# EAGLE design 音声ガイド (EAGLE 9.7.0)
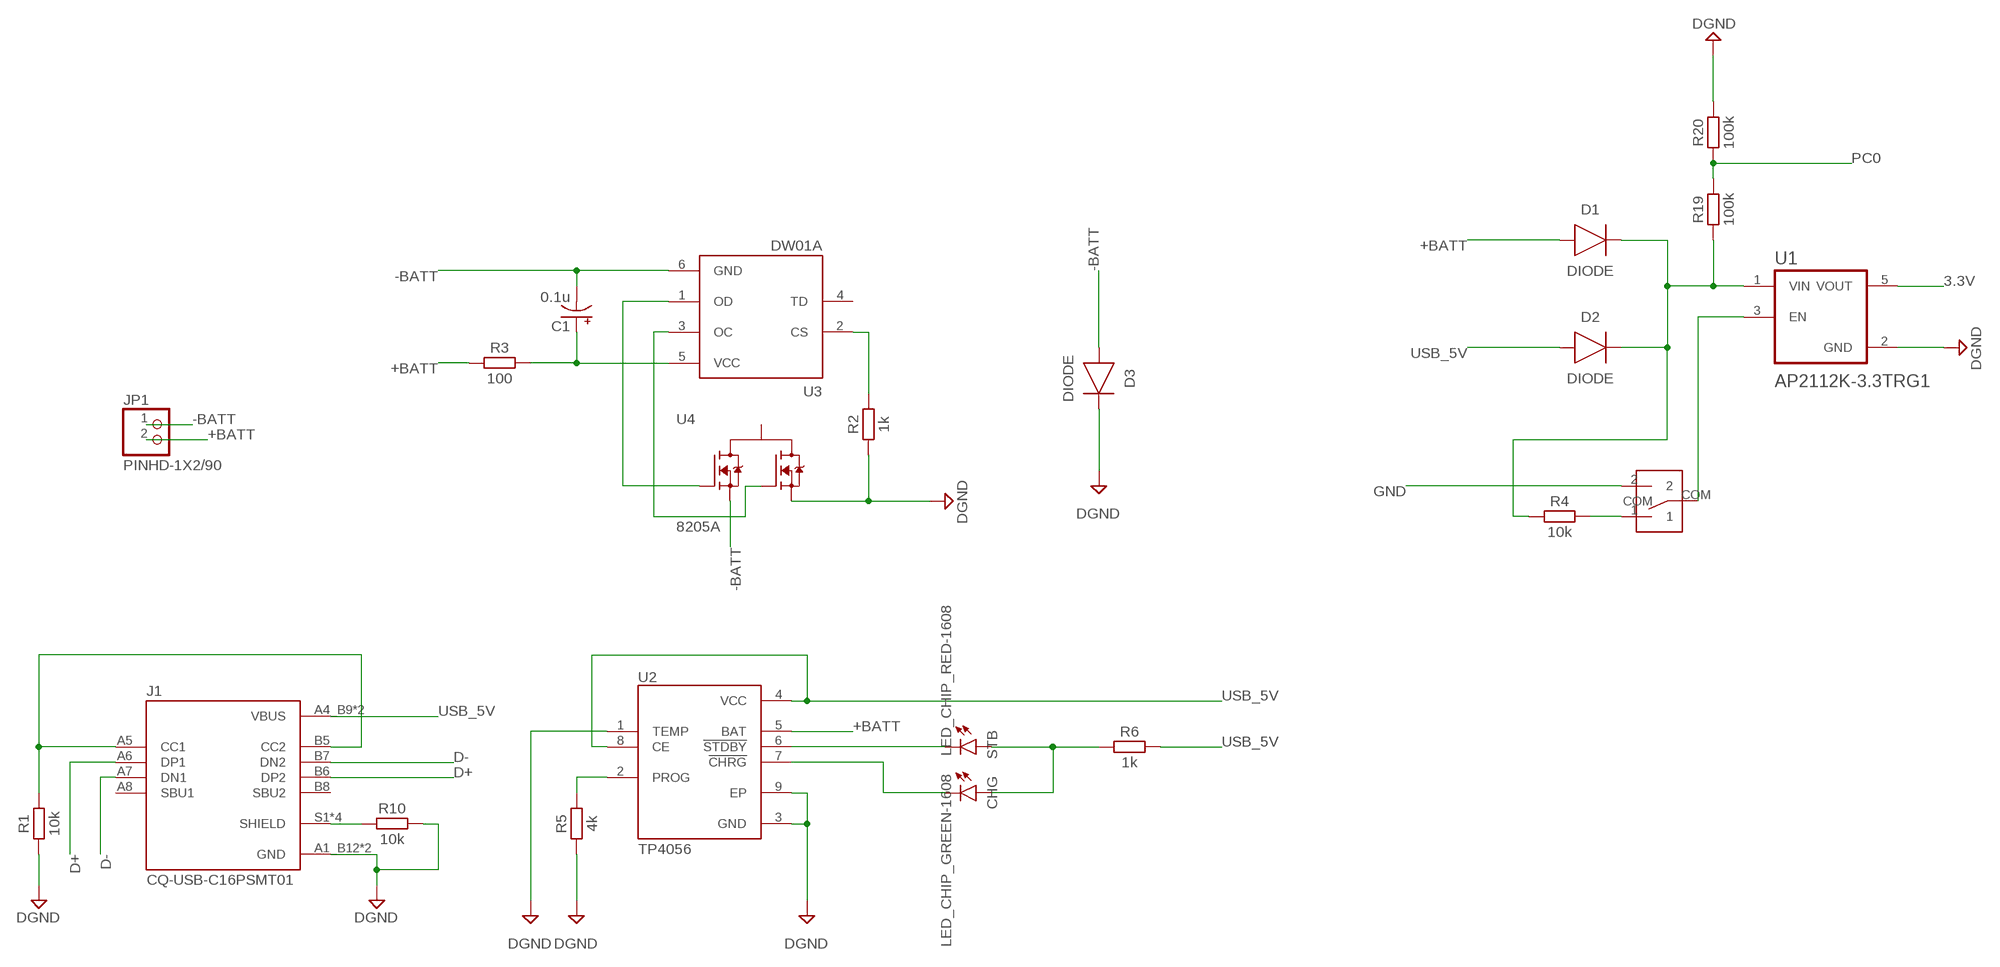
[diagram p0: schematic, sheet 1, part 1 of 2]
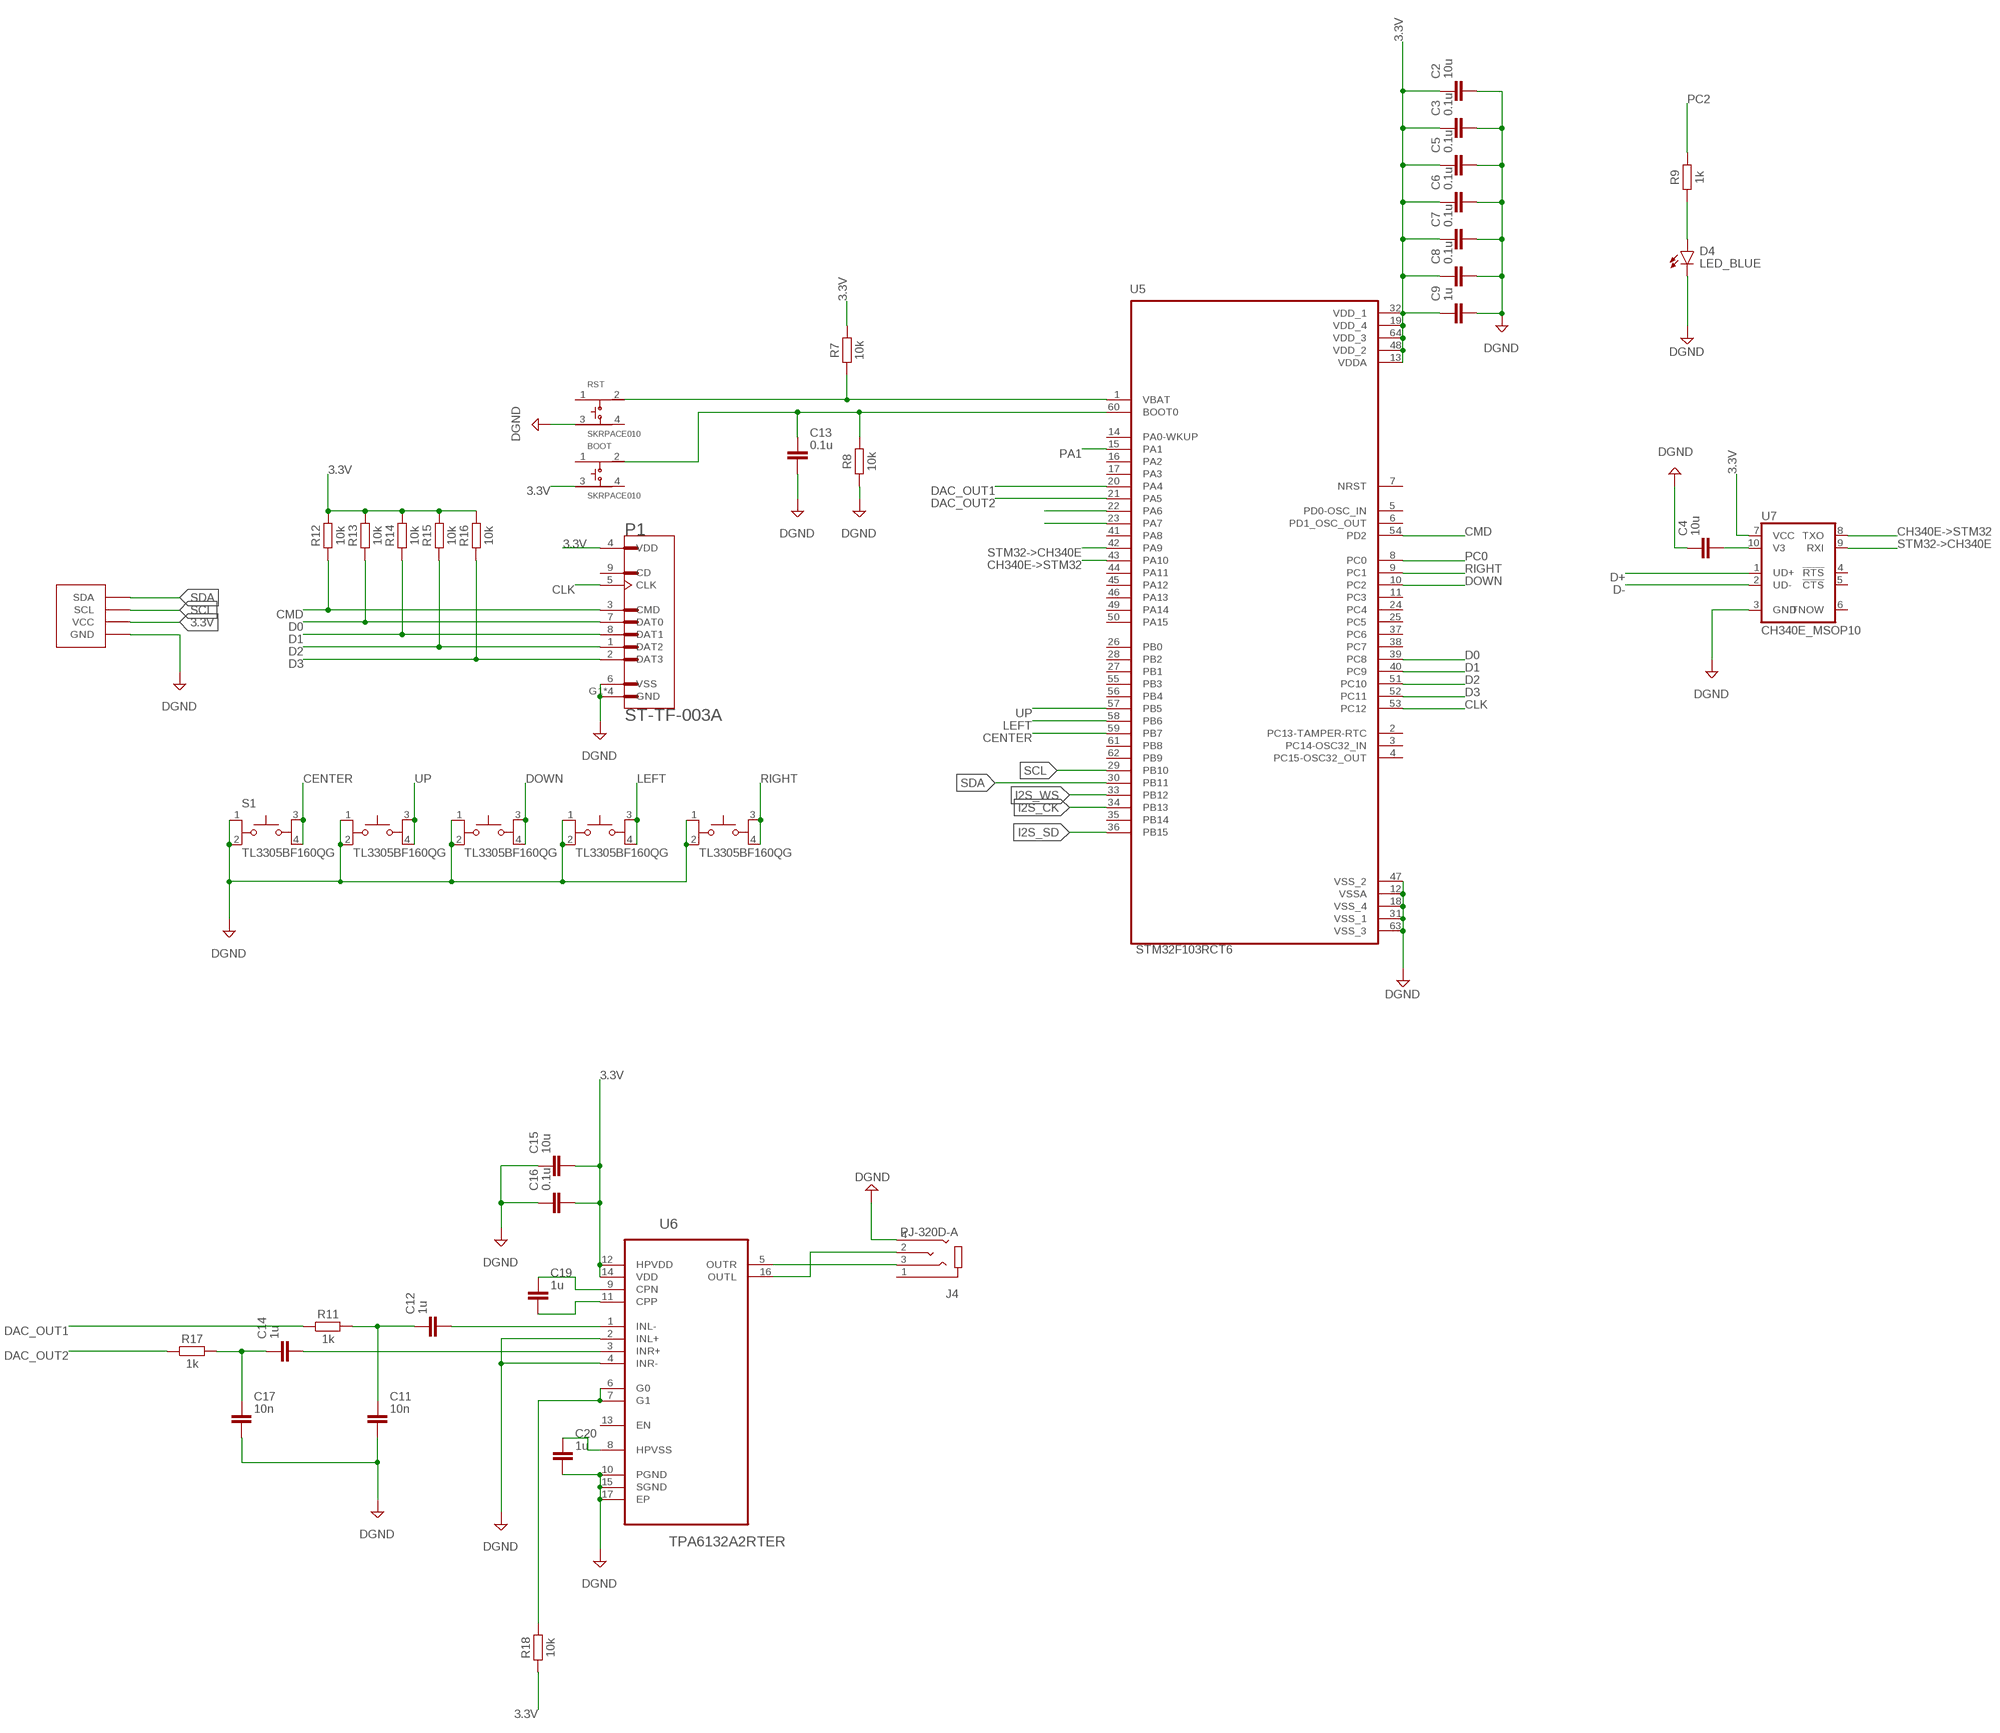
[diagram p1: schematic, sheet 1, part 2 of 2]

## Parts
BOOT  SKRPACE010  [SW_SKRPACE010]
C1  0.1u  C-POL-US_TANTALUM-1206(3216-METRIC)  [CAPMP3216X180N]
C2  10u  C_CHIP-0402(1005-METRIC)  [CAPC1005X60]
C3  0.1u  C_CHIP-0402(1005-METRIC)  [CAPC1005X60]
C4  10u  C_CHIP-0402(1005-METRIC)  [CAPC1005X60]
C5  0.1u  C_CHIP-0402(1005-METRIC)  [CAPC1005X60]
C6  0.1u  C_CHIP-0402(1005-METRIC)  [CAPC1005X60]
C7  0.1u  C_CHIP-0402(1005-METRIC)  [CAPC1005X60]
C8  0.1u  C_CHIP-0402(1005-METRIC)  [CAPC1005X60]
C9  1u  C_CHIP-0402(1005-METRIC)  [CAPC1005X60]
C11  10n  C_CHIP-0402(1005-METRIC)  [CAPC1005X60]
C12  1u  C_CHIP-0402(1005-METRIC)  [CAPC1005X60]
C13  0.1u  C_CHIP-0402(1005-METRIC)  [CAPC1005X60]
C14  1u  C_CHIP-0402(1005-METRIC)  [CAPC1005X60]
C15  10u  C_CHIP-0402(1005-METRIC)  [CAPC1005X60]
C16  0.1u  C_CHIP-0402(1005-METRIC)  [CAPC1005X60]
C17  10n  C_CHIP-0402(1005-METRIC)  [CAPC1005X60]
C19  1u  C_CHIP-0402(1005-METRIC)  [CAPC1005X60]
C20  1u  C_CHIP-0402(1005-METRIC)  [CAPC1005X60]
CHG  LED_CHIP_GREEN-1608  [LEDC1608X39N_G]
D1  DIODE  DIODEDO-214AC(SMA)  [DIOM5226X290N]
D2  DIODE  DIODEDO-214AC(SMA)  [DIOM5226X290N]
D3  DIODE  DIODEDO-214AC(SMA)  [DIOM5226X290N]
D4  LED_BLUE  CHIP-FLAT-B_0603-0.35MM  [LEDC1608X35N_FLAT-B]
J1  CQ-USB-C16PSMT01  [SHENZHEN-CHUANGQIN-TECHNOLOGY_CQ-USB-C16PSMT01]
J4  PJ-320D-A  [HRO_PJ-320D-A]
JP1  PINHD-1X2/90  [1X02/90]
P1  ST-TF-003A  [SUNTECH_ST-TF-003A]
R1  10k  R_CHIP-0603(1608-METRIC)  [RESC1608X60]
R2  1k  R_CHIP-0603(1608-METRIC)  [RESC1608X60]
R3  100  R_CHIP-0603(1608-METRIC)  [RESC1608X60]
R4  10k  R_CHIP-0603(1608-METRIC)  [RESC1608X60]
R5  4k  R_CHIP-0603(1608-METRIC)  [RESC1608X60]
R6  1k  R_CHIP-0603(1608-METRIC)  [RESC1608X60]
R7  10k  R_CHIP-0603(1608-METRIC)  [RESC1608X60]
R8  10k  R_CHIP-0603(1608-METRIC)  [RESC1608X60]
R9  1k  R_CHIP-0603(1608-METRIC)  [RESC1608X60]
R10  10k  R_CHIP-0603(1608-METRIC)  [RESC1608X60]
R11  1k  R_CHIP-0603(1608-METRIC)  [RESC1608X60]
R12  10k  R_CHIP-0603(1608-METRIC)  [RESC1608X60]
R13  10k  R_CHIP-0603(1608-METRIC)  [RESC1608X60]
R14  10k  R_CHIP-0603(1608-METRIC)  [RESC1608X60]
R15  10k  R_CHIP-0603(1608-METRIC)  [RESC1608X60]
R16  10k  R_CHIP-0603(1608-METRIC)  [RESC1608X60]
R17  1k  R_CHIP-0603(1608-METRIC)  [RESC1608X60]
R18  10k  R_CHIP-0603(1608-METRIC)  [RESC1608X60]
R19  100k  R_CHIP-0603(1608-METRIC)  [RESC1608X60]
R20  100k  R_CHIP-0603(1608-METRIC)  [RESC1608X60]
RST  SKRPACE010  [SW_SKRPACE010]
S1  TL3305BF160QG  [SW_TL3305BF160QG]
S2  TL3305BF160QG  [SW_TL3305BF160QG]
S3  TL3305BF160QG  [SW_TL3305BF160QG]
S4  TL3305BF160QG  [SW_TL3305BF160QG]
S5  TL3305BF160QG  [SW_TL3305BF160QG]
STB  LED_CHIP_RED-1608  [LEDC1608X39N_R]
SW1  SK12D07VG4  [SK12D07VG4]
U1  AP2112K-3.3TRG1  [SOT95P285X140-5N]
U2  TP4056  [SOP127P600X175-9N]
U3  DW01A  [SOT95P280X145-6N]
U4  8205A  [SOT95P285X140-6N]
U5  STM32F103RCT6  [QFP50P1200X1200X160-64N]
U6  TPA6132A2RTER  [QFN50P300X300X80-16N]
U7  CH340E_MSOP10  [MSOP10]
U$1  HS96L03W2C03  [HS96L03W2C03]

## Nets
3.3V: BOOT.3 C2.1 C3.1 C5.1 C6.1 C7.1 C8.1 C9.1 C15.2 C16.2 P1.4(VDD) R7.2 R12.2 R13.2 R14.2 R15.2 R16.2 R18.1 U1.5(VOUT) U5.13(VDDA) U5.19(VDD_4) U5.32(VDD_1) U5.48(VDD_2) U5.64(VDD_3) U6.12(HPVDD) U6.14(VDD) U7.7(VCC) U$1.P$2(VCC)
+BATT: D1.2(A) JP1.2 R3.1 U2.5(BAT)
-BATT: C1.2(-) D3.2(A) JP1.1 U3.6(GND) U4.1(S1)
CENTER: S1.3 S1.4 U5.59(PB7)
CH340E->STM32: U5.43(PA10) U7.8(TXO)
CLK: P1.5(CLK) U5.53(PC12)
CMD: P1.3(CMD) R12.1 U5.54(PD2)
D0: P1.7(DAT0) R13.1 U5.39(PC8)
D1: P1.8(DAT1) R14.1 U5.40(PC9)
D2: P1.1(DAT2) R15.1 U5.51(PC10)
D3: P1.2(DAT3) R16.1 U5.52(PC11)
D+: J1.A6(DP1) J1.B6(DP2) U7.1(UD+)
D-: J1.A7(DN1) J1.B7(DN2) U7.2(UD-)
DAC_OUT1: R11.1 U5.20(PA4)
DAC_OUT2: R17.1 U5.21(PA5)
DGND: C2.2 C3.2 C4.1 C5.2 C6.2 C7.2 C8.2 C9.2 C11.2 C13.2 C15.1 C16.1 C17.2 C20.2 D3.1(C) D4.C J1.A1_B12(GND) J1.B1_A12(GND) J4.4(RING2) P1.6(VSS) P1.G1(GND) P1.G2(GND) P1.G3(GND) P1.G4(GND) R1.1 R2.1 R5.1 R8.1 R10.2 R20.2 RST.3 S1.1 S1.2 S2.1 S2.2 S3.1 S3.2 S4.1 S4.2 S5.1 S5.2 U1.2(GND) U2.1(TEMP) U2.3(GND) U2.9(EP) U4.3(S2) U5.12(VSSA) U5.18(VSS_4) U5.31(VSS_1) U5.47(VSS_2) U5.63(VSS_3) U6.2(INL+) U6.4(INR-) U6.10(PGND) U6.15(SGND) U6.17(EP) U7.3(GND) U$1.P$1(GND)
DOWN: S3.3 S3.4 U5.10(PC2)
GND: SW1.2
I2S_CK: U5.34(PB13)
I2S_SD: U5.36(PB15)
I2S_WS: U5.33(PB12)
LEFT: S4.3 S4.4 U5.58(PB6)
N$1: J1.A5(CC1) J1.B5(CC2) R1.2
N$2: U3.1(OD) U4.6(G1)
N$3: U3.3(OC) U4.4(G2)
N$4: R5.2 U2.2(PROG)
N$5: R2.2 U3.2(CS)
N$6: SW1.COM U1.3(EN)
N$7: C1.1(+) R3.2 U3.5(VCC)
N$8: R4.2 SW1.1
N$9: STB.1(C) U2.6(!STDBY)
N$10: D1.1(C) D2.1(C) R4.1 R19.1 U1.1(VIN)
N$11: CHG.1(C) U2.7(!CHRG)
N$12: CHG.2(A) R6.1 STB.2(A)
N$13: R7.1 RST.2 U5.1(VBAT)
N$14: BOOT.2 C13.1 R8.2 U5.60(BOOT0)
N$15: D4.A R9.1
N$16: J1.S1(SHIELD) J1.S2(SHIELD) J1.S3(SHIELD) J1.S4(SHIELD) R10.1
N$17: C11.1 C12.1 R11.2
N$18: C12.2 U6.1(INL-)
N$19: J4.2(TIP) U6.16(OUTL)
N$20: J4.3(RING1) U6.5(OUTR)
N$21: C14.1 C17.1 R17.2
N$22: C14.2 U6.3(INR+)
N$23: C4.2 U7.10(V3)
N$24: C19.1 U6.9(CPN)
N$25: C19.2 U6.11(CPP)
N$26: C20.1 U6.8(HPVSS)
N$27: R18.2 U6.6(G0) U6.7(G1)
N$33: U5.22(PA6)
N$34: U5.23(PA7)
PA1: U5.15(PA1)
PC0: R19.2 R20.1 U5.8(PC0)
PC2: R9.2
RIGHT: S5.3 S5.4 U5.9(PC1)
SCL: U5.29(PB10) U$1.P$3(SCL)
SDA: U5.30(PB11) U$1.P$4(SDA)
STM32->CH340E: U5.42(PA9) U7.9(RXI)
UP: S2.3 S2.4 U5.57(PB5)
USB_5V: D2.2(A) J1.A4_B9(VBUS) J1.B4_A9(VBUS) R6.2 U2.4(VCC) U2.8(CE)
Unconnected: BOOT.1 BOOT.4 J1.A8(SBU1) J1.B8(SBU2) J4.1(SLEEVE) P1.9(CD) RST.1 RST.4 U3.4(TD) U4.2(D1_D2) U4.5(D1_D2) U5.2(PC13-TAMPER-RTC) U5.3(PC14-OSC32_IN) U5.4(PC15-OSC32_OUT) U5.5(PD0-OSC_IN) U5.6(PD1_OSC_OUT) U5.7(NRST) U5.11(PC3) U5.14(PA0-WKUP) U5.16(PA2) U5.17(PA3) U5.24(PC4) U5.25(PC5) U5.26(PB0) U5.27(PB1) U5.28(PB2) U5.35(PB14) U5.37(PC6) U5.38(PC7) U5.41(PA8) U5.44(PA11) U5.45(PA12) U5.46(PA13) U5.49(PA14) U5.50(PA15) U5.55(PB3) U5.56(PB4) U5.61(PB8) U5.62(PB9) U6.13(EN) U7.4(!RTS) U7.5(!CTS) U7.6(TNOW)

## Library data of the parts
BOOT RST = SKRPACE010:SKRPACE010: Check availability <https://pricing.snapeda.com/parts/SKRPACE010/ALPS/view-part?ref=eda>; AVAILABILITY: In Stock; CHECK_PRICES: https://www.snapeda.com/parts/SKRPACE010/ALPS/view-part/?ref=eda; DESCRIPTION: Switch Tactile N.O. SPST Button J-Bend 0.05A 16VDC 2.55N SMD Automotive T/R; MF: ALPS; MP: SKRPACE010; PACKAGE: None; PRICE: None; SNAPEDA_LINK: https://www.snapeda.com/parts/SKRPACE010/ALPS/view-part/?ref=snap
C1 = Capacitor:C-POL-US: Capacitor Polarised - ANSI; CATEGORY: Capacitor
C2-C9 C11-C17 C19 C20 = Tutorial - Fusion 360:C: Capacitor - Generic; CATEGORY: Capacitor
CHG = Tutorial - Fusion 360:LED_CHIP: LED - Generic; CATEGORY: Opto-Electronic; COLOR: Green; SUB-CATEGORY: LED
D1-D3 = Diode:DIODE: Diode Rectifier - Generic; CATEGORY: Diode; SUB-CATEGORY: Rectifier
D4 = LED:CHIP-FLAT-B; CATEGORY: LED; COLOR: BLUE; DESCRIPTION: CHIP LED FLAT; SUB-CATEGORY: CHIP; TYPE: FLAT_TOP
J1 = USB type-C:CQ-USB-C16PSMT01: Check availability <https://pricing.snapeda.com/parts/CQ-USB-C16PSMT01/Shenzen%20Chuangqin%20Technology/view-part?ref=eda>; AVAILABILITY: Not in stock; CHECK_PRICES: https://www.snapeda.com/parts/CQ-USB-C16PSMT01/Shenzen+Chuangqin+Technology/view-part/?ref=eda; DESCRIPTION: C Type USB Type-C Female Plug 16 Pin Connector Power Charger Jack Port; MF: Shenzen Chuangqin Technology; MP: CQ-USB-C16PSMT01; PACKAGE: Package; PRICE: None; SNAPEDA_LINK: https://www.snapeda.com/parts/CQ-USB-C16PSMT01/Shenzen+Chuangqin+Technology/view-part/?ref=snap
J4 = PJ-320D-A:PJ-320D-A: Check availability <https://pricing.snapeda.com/parts/PJ-320D-A/HRO%20Electronics%20Co.%2C%20Ltd./view-part?ref=eda>; AVAILABILITY: Not in stock; CHECK_PRICES: https://www.snapeda.com/parts/PJ-320D-A/HRO+Electronics+Co.%252C+Ltd./view-part/?ref=eda; DESCRIPTION: Headphone jack 0.5A 30V DC 100 mΩ; MF: HRO Electronics Co., Ltd.; MP: PJ-320D-A; PACKAGE: Package; PRICE: None; SNAPEDA_LINK: https://www.snapeda.com/parts/PJ-320D-A/HRO+Electronics+Co.%252C+Ltd./view-part/?ref=snap
JP1 = Connector:PINHD-1X2: PIN HEADER; CATEGORY: Headers; DESCRIPTION: Header, Right Angle, 2 Position; MANUFACTURER: Generic; MPN: Generic; OPERATING_TEMPERATURE: Generic; PART_STATUS: Active; PITCH: 0.100" (2.54mm); ROHS_COMPLIANCE: Generic; SERIES: Generic; SUB-CATEGORY: Headers, Male Pins; TYPE: Board to Board or Cable, Unshrouded, Through Hole, Right Angle
P1 = ST-TF-003A:ST-TF-003A: Check availability <https://pricing.snapeda.com/parts/ST-TF-003A/Suntech/view-part?ref=eda>; AVAILABILITY: Not in stock; CHECK_PRICES: https://www.snapeda.com/parts/ST-TF-003A/Suntech/view-part/?ref=eda; DESCRIPTION: Micro SD Card Socket; MF: Suntech; MP: ST-TF-003A; PACKAGE: None; PRICE: None; SNAPEDA_LINK: https://www.snapeda.com/parts/ST-TF-003A/Suntech/view-part/?ref=snap
R1-R20 = Resistor:R: Resistor Fixed - Generic; CATEGORY: Resistor; SUB-CATEGORY: Fixed
S1-S5 = TL3305BF160QG:TL3305BF160QG: Check availability <https://pricing.snapeda.com/parts/TL3305BF160QG/E-Switch/view-part?ref=eda>; AVAILABILITY: In Stock; CHECK_PRICES: https://www.snapeda.com/parts/TL3305BF160QG/E-Switch/view-part/?ref=eda; DESCRIPTION: Tactile Switch SPST-NO Top Actuated Surface Mount; MF: E-Switch; MP: TL3305BF160QG; PACKAGE: None; PRICE: None; SNAPEDA_LINK: https://www.snapeda.com/parts/TL3305BF160QG/E-Switch/view-part/?ref=snap
STB = Tutorial - Fusion 360:LED_CHIP: LED - Generic; CATEGORY: Opto-Electronic; COLOR: Red; SUB-CATEGORY: LED
SW1 = SK12D07VG4:SK12D07VG4
U1 = AP2112K-3.3TRG1:AP2112K-3.3TRG1: Check availability <https://pricing.snapeda.com/parts/AP2112K-3.3TRG1/Diodes%20Inc./view-part?ref=eda>; AVAILABILITY: In Stock; CHECK_PRICES: https://www.snapeda.com/parts/AP2112K-3.3TRG1/Diodes+Inc./view-part/?ref=eda; DESCRIPTION: Voltage Regulators, LDO, 600mA CMOS LDO 50mA 3.3V 250mV | Diodes Inc AP2112K-3.3TRG1; MF: Diodes Inc.; MP: AP2112K-3.3TRG1; PACKAGE: SOT-753 Diodes Inc.; PRICE: None; SNAPEDA_LINK: https://www.snapeda.com/parts/AP2112K-3.3TRG1/Diodes+Inc./view-part/?ref=snap
U2 = TP4056:TP4056: Check availability <https://pricing.snapeda.com/parts/TP4056/NanJing%20Top%20Power%20ASIC%20Corp./view-part?ref=eda>; AVAILABILITY: Not in stock; CHECK_PRICES: https://www.snapeda.com/parts/TP4056/NanJing+Top+Power+ASIC+Corp./view-part/?ref=eda; DESCRIPTION: Complete single cell Li-Ion battery with a constant current / constant voltage linear charger; MF: NanJing Top Power ASIC Corp.; MP: TP4056; PACKAGE: Package; PRICE: None; SNAPEDA_LINK: https://www.snapeda.com/parts/TP4056/NanJing+Top+Power+ASIC+Corp./view-part/?ref=snap
U3 = DW01A:DW01A: Check availability <https://pricing.snapeda.com/parts/DW01A/Fortune%20Semiconductor/view-part?ref=eda>; AVAILABILITY: Not in stock; CHECK_PRICES: https://www.snapeda.com/parts/DW01A/Fortune+Semiconductor/view-part/?ref=eda; DESCRIPTION: One Cell Lithium-ion/Polymer Battery Protection IC; MF: Fortune Semiconductor; MP: DW01A; PACKAGE: SOT-23-6 Fortune Semiconductor; PRICE: None; SNAPEDA_LINK: https://www.snapeda.com/parts/DW01A/Fortune+Semiconductor/view-part/?ref=snap
U4 = 8205A:8205A: Check availability <https://pricing.snapeda.com/parts/8205A/GUANGDONG%20HOTTECH%20INDUSTRIAL%20CO.%2CLTD./view-part?ref=eda>; AVAILABILITY: In Stock; CHECK_PRICES: https://www.snapeda.com/parts/8205A/Xmore+Industrial/view-part/?ref=eda; DESCRIPTION: Dual N-Channel Enhancement Mode MOSFET; MF: GUANGDONG HOTTECH INDUSTRIAL CO.,LTD.; MP: 8205A; PACKAGE: SOT-23 GUANGDONG HOTTECH INDUSTRIAL CO.,LTD.; PRICE: None; SNAPEDA_LINK: https://www.snapeda.com/parts/8205A/Xmore+Industrial/view-part/?ref=snap
U5 = STM32F103RCT6:STM32F103RCT6: Check availability <https://pricing.snapeda.com/parts/STM32F103RCT6/STMicroelectronics/view-part?ref=eda>; AVAILABILITY: In Stock; CHECK_PRICES: https://www.snapeda.com/parts/STM32F103RCT6/STMicroelectronics/view-part/?ref=eda; DESCRIPTION: ARM® Cortex®-M3 STM32F1 Microcontroller IC 32-Bit 72MHz 256KB (256K x 8) FLASH 64-LQFP (10x10); MF: STMicroelectronics; MP: STM32F103RCT6; PACKAGE: LQFP-64 STMicroelectronics; PRICE: None; SNAPEDA_LINK: https://www.snapeda.com/parts/STM32F103RCT6/STMicroelectronics/view-part/?ref=snap
U6 = TPA6132A2RTER:TPA6132A2RTER: Check availability <https://pricing.snapeda.com/parts/TPA6132A2RTER/Texas%20Instruments/view-part?ref=eda>; AVAILABILITY: In Stock; CHECK_PRICES: https://www.snapeda.com/parts/TPA6132A2RTER/Texas+Instruments/view-part/?ref=eda; DESCRIPTION: 25-mW, stereo, analog input headphone amplifier in WQFN; MF: Texas Instruments; MP: TPA6132A2RTER; PACKAGE: WQFN-16 Texas Instruments; PRICE: None; SNAPEDA_LINK: https://www.snapeda.com/parts/TPA6132A2RTER/Texas+Instruments/view-part/?ref=snap
U7 = CH340E:CH340E: Check availability <https://pricing.snapeda.com/parts/CH340E/WCH/view-part?ref=eda>; AVAILABILITY: Not in stock; CHECK_PRICES: https://www.snapeda.com/parts/CH340E/WCH/view-part/?ref=eda; DESCRIPTION: USB to serial chip CH340; MF: WCH; MP: CH340E; PACKAGE: Package; PRICE: None; SNAPEDA_LINK: https://www.snapeda.com/parts/CH340E/WCH/view-part/?ref=snap
U$1 = HS96L03W2C03:HS96L03W2C03

## Board
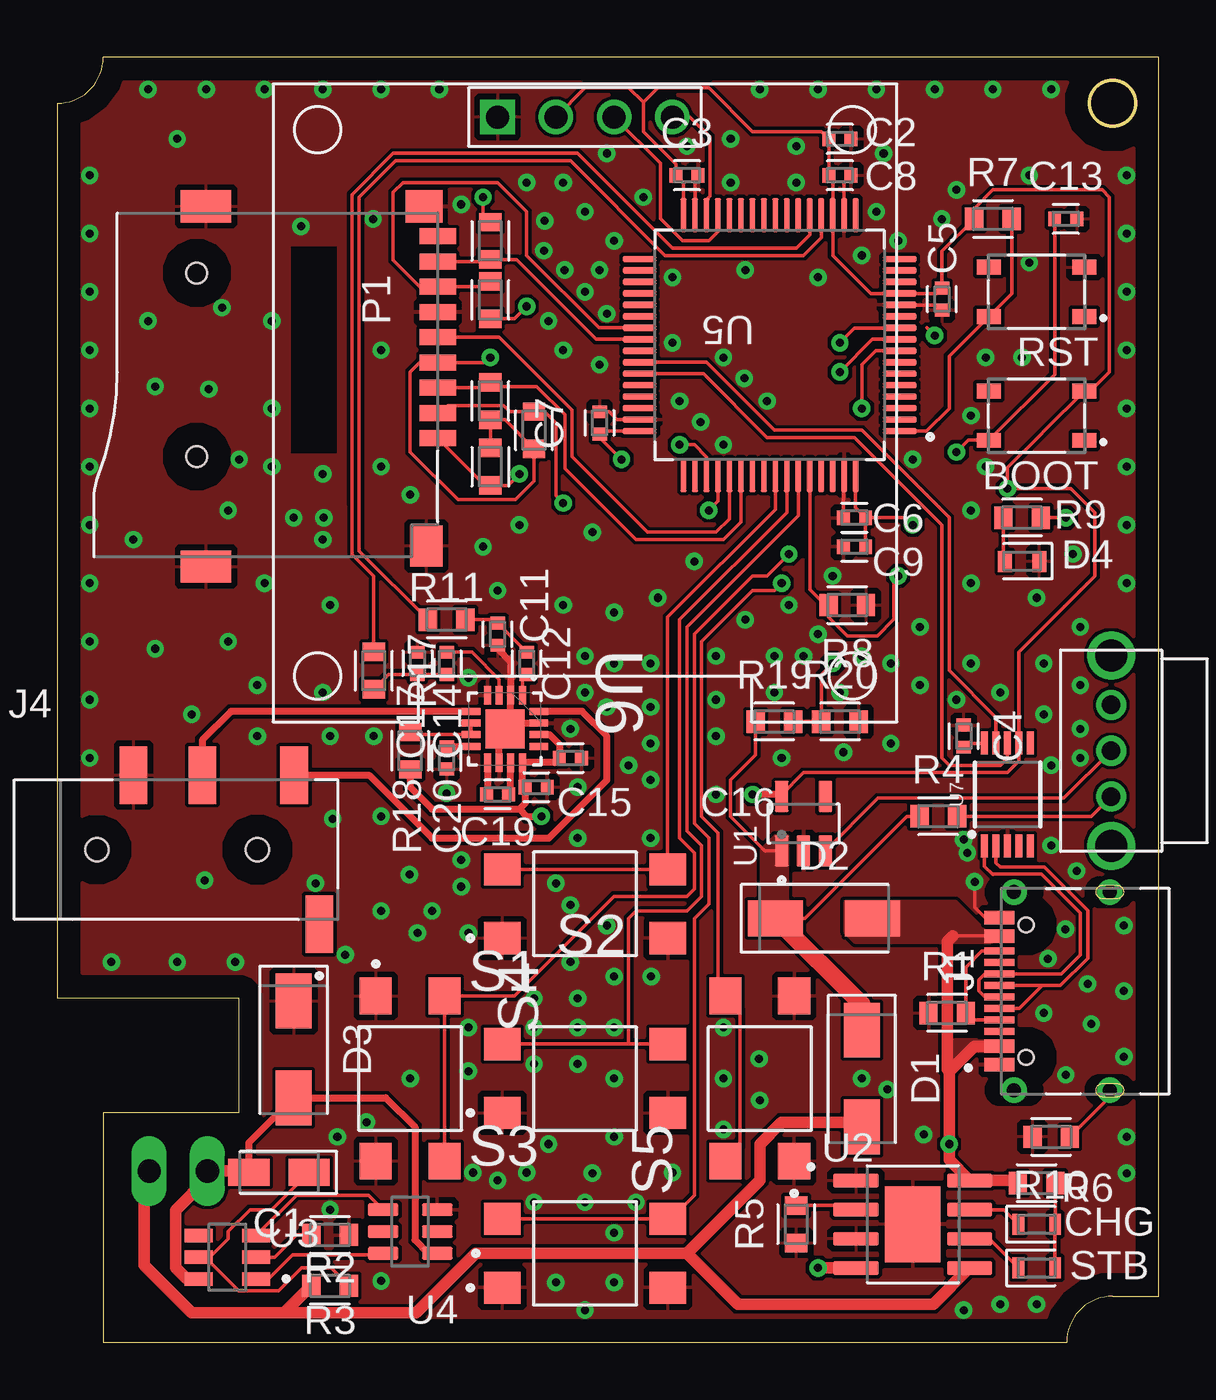
[diagram p2: board, top side]
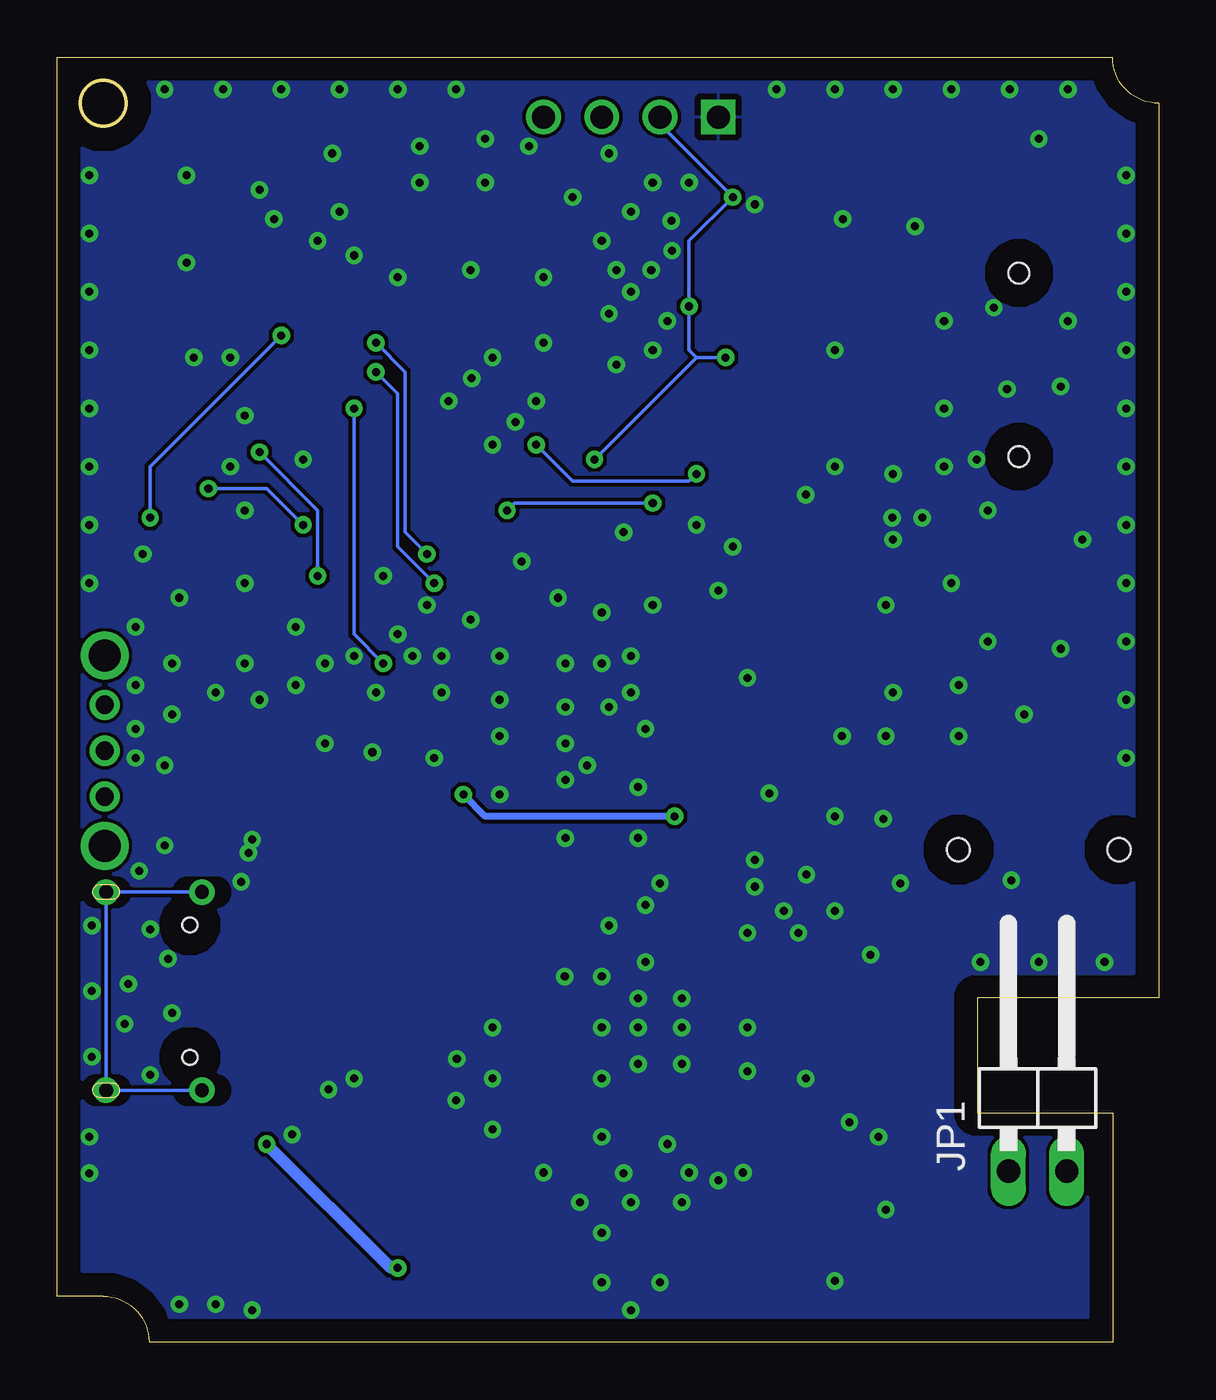
[diagram p3: board, bottom side, seen from below]

Size 48 x 56 mm. Coordinates in mm from the lower left corner, seen from the top.
Outline: 0,54 0,15 7.9,15 7.9,10 2,10 2,0 44,0 arc-90 46,2 48,2 48,56 2,56 arc-90 0,54
Outline: circle at 46,54 radius 1
Copper layers (1*16): Top / Bottom
Stack-up Default Layer Stack: Top User Defined 0.035mm / Dielectric-1 User Defined 1.5mm / Bottom User Defined 0.035mm
Design rules: minimum copper width 6mil, minimum drill size 0.35mm, copper clearance wire_polygon to wire_polygon 6mil, copper clearance wire_polygon to pad_smd 6mil, copper clearance wire_polygon to via 6mil, copper clearance pad_smd to pad_smd 6mil, copper clearance pad_smd to via 6mil, copper clearance via to via 6mil, copper clearance smd to pad (same net) 6mil, copper clearance smd to via (same net) 6mil, copper clearance smd to smd (same net) 6mil, dimension clearance 40mil, via restrict clearance 0mil, restrict clearance 0mil, drill distance 6mil, keepout clearance 0mil

### Footprints (pad centres in the part's own frame; a part is rotated, then mirrored left to right if it is on the bottom)
SW_SKRPACE010 = smd 1.05 x 0.65: 1 -2.075,1.075; 2 2.075,1.075; 3 -2.075,-1.075; 4 2.075,-1.075
CAPMP3216X180N = smd 1.796 x 1.189: 1 -1.31,0; 2 1.31,0
CAPC1005X60 = smd 0.56 x 0.629: 1 -0.485,0; 2 0.485,0
LEDC1608X39N_G = smd 0.512 x 0.912: 1 -0.8,0; 2 0.8,0
DIOM5226X290N = smd 2.392 x 1.565: 1 -2.108,0; 2 2.108,0
LEDC1608X35N_FLAT-B = smd 0.612 x 0.912: A 0.75,0; C -0.75,0
SHENZHEN-CHUANGQIN-TECHNOLOGY_CQ-USB-C16PSMT01 = smd 0.6 x 1.3: A1_B12 -3.2,0; A4_B9 -2.4,0; B1_A12 3.2,0; B4_A9 2.4,0 | smd 0.3 x 1.3: A5 -1.25,0; A6 -0.25,0; A7 0.25,0; A8 1.25,0; B5 1.75,0; B6 0.75,0; B7 -0.75,0; B8 -1.75,0 | drill 0.6 slot 1.778 rotated 90: S1 -4.32,-0.64; S2 4.32,-0.64 | drill 0.6 slot 1.4 rotated 90: S3 -4.32,-4.82; S4 4.32,-4.82 | hole 0.65: -2.89,-1.17; 2.89,-1.17
HRO_PJ-320D-A = smd 1.2 x 2.5: 1 6.2,-3.25; 2 5.1,3.25; 3 1.1,3.25; 4 -1.9,3.25 | hole 1: -3.5,0; 3.5,0
1X02/90 = drill 1.016 long: 1 -1.27,-3.81; 2 1.27,-3.81
SUNTECH_ST-TF-003A = smd 0.7 x 1.6: 1 3.52,5.33; 2 2.42,5.33; 3 1.32,5.33; 4 0.22,5.33; 5 -0.88,5.33; 6 -1.98,5.33; 7 -3.08,5.33; 8 -4.18,5.33; 9 -5.28,5.33 | smd 1.4 x 1.6: G1 -6.58,4.73 | smd 1.4 x 2.2: G2 -6.58,-4.77; G3 9.12,-4.77 | smd 1.8 x 1.4: G4 8.22,4.83 | hole 0.9: -3.68,-5.17; 4.32,-5.17
RESC1608X60 = smd 0.799 x 0.974: 1 -0.815,0; 2 0.815,0
SW_TL3305BF160QG = smd 1.6 x 1.4: 1 -3.6,-1.5; 2 3.6,-1.5; 3 -3.6,1.5; 4 3.6,1.5
LEDC1608X39N_R = smd 0.512 x 0.912: 1 -0.8,0; 2 0.8,0
SK12D07VG4 = drill 0.8: 1 -2,0; 2 2,0; COM 0,0 | drill 1.4: M1 -4.15,0; M2 4.15,0
SOT95P285X140-5N = smd 1.35 x 0.6: 1 -1.185,0.95; 2 -1.185,0; 3 -1.185,-0.95; 4 1.185,-0.95; 5 1.185,0.95
SOP127P600X175-9N = smd 1.97 x 0.6: 1 -2.475,1.905; 2 -2.475,0.635; 3 -2.475,-0.635; 4 -2.475,-1.905; 5 2.475,-1.905; 6 2.475,-0.635; 7 2.475,0.635; 8 2.475,1.905 | smd 2.413 x 3.302: 9 0,0
SOT95P280X145-6N = smd 1.21 x 0.59: 1 -1.255,0.95; 2 -1.255,0; 3 -1.255,-0.95; 4 1.255,-0.95; 5 1.255,0; 6 1.255,0.95
SOT95P285X140-6N = smd 1.35 x 0.56: 1 -1.185,0.95; 2 -1.185,0; 3 -1.185,-0.95; 4 1.185,-0.95; 5 1.185,0; 6 1.185,0.95
QFP50P1200X1200X160-64N = smd 1.49 x 0.28: 1 -5.67,3.75; 2 -5.67,3.25; 3 -5.67,2.75; 4 -5.67,2.25; 5 -5.67,1.75; 6 -5.67,1.25; 7 -5.67,0.75; 8 -5.67,0.25; 9 -5.67,-0.25; 10 -5.67,-0.75; 11 -5.67,-1.25; 12 -5.67,-1.75; 13 -5.67,-2.25; 14 -5.67,-2.75; 15 -5.67,-3.25; 16 -5.67,-3.75; 33 5.67,-3.75; 34 5.67,-3.25; 35 5.67,-2.75; 36 5.67,-2.25; 37 5.67,-1.75; 38 5.67,-1.25; 39 5.67,-0.75; 40 5.67,-0.25; 41 5.67,0.25; 42 5.67,0.75; 43 5.67,1.25; 44 5.67,1.75; 45 5.67,2.25; 46 5.67,2.75; 47 5.67,3.25; 48 5.67,3.75 | smd 0.28 x 1.49: 17 -3.75,-5.67; 18 -3.25,-5.67; 19 -2.75,-5.67; 20 -2.25,-5.67; 21 -1.75,-5.67; 22 -1.25,-5.67; 23 -0.75,-5.67; 24 -0.25,-5.67; 25 0.25,-5.67; 26 0.75,-5.67; 27 1.25,-5.67; 28 1.75,-5.67; 29 2.25,-5.67; 30 2.75,-5.67; 31 3.25,-5.67; 32 3.75,-5.67; 49 3.75,5.67; 50 3.25,5.67; 51 2.75,5.67; 52 2.25,5.67; 53 1.75,5.67; 54 1.25,5.67; 55 0.75,5.67; 56 0.25,5.67; 57 -0.25,5.67; 58 -0.75,5.67; 59 -1.25,5.67; 60 -1.75,5.67; 61 -2.25,5.67; 62 -2.75,5.67; 63 -3.25,5.67; 64 -3.75,5.67
QFN50P300X300X80-16N = smd 0.813 x 0.305: 1 -1.473,0.762; 2 -1.473,0.254; 3 -1.473,-0.254; 4 -1.473,-0.762; 9 1.473,-0.762; 10 1.473,-0.254; 11 1.473,0.254; 12 1.473,0.762 | smd 0.305 x 0.813: 5 -0.762,-1.473; 6 -0.254,-1.473; 7 0.254,-1.473; 8 0.762,-1.473; 13 0.762,1.473; 14 0.254,1.473; 15 -0.254,1.473; 16 -0.762,1.473 | smd 1.702 x 1.702: 17 0,0
MSOP10 = smd 1 x 0.3: 1 -2.25,1; 2 -2.25,0.5; 3 -2.25,0; 4 -2.25,-0.5; 5 -2.25,-1; 6 2.25,-1; 7 2.25,-0.5; 8 2.25,0; 9 2.25,0.5; 10 2.25,1
HS96L03W2C03 = drill 1 square: P$1 -3.81,0 | drill 1: P$2 -1.27,0; P$3 1.27,0; P$4 3.81,0

### Placement (x,y rotation side)
BOOT  42.69,40.38 180 top
C1  9.66,7.4 180 top
C2  34.11,52.45 0 top
C3  27.45,50.86 0 top
C4  39.51,26.41 270 top
C5  38.56,45.46 270 top
C6  34.75,35.94 180 top
C7  23.64,40.06 90 top
C8  34.11,50.86 0 top
C9  34.75,34.67 180 top
C11  19.19,30.86 270 top
C12  20.46,29.59 270 top
C13  43.95,48.95 0 top
C14  16.97,29.59 90 top
C15  20.87,24.19 180 top
C16  22.36,25.46 180 top
C17  15.7,29.59 90 top
C19  19.19,23.87 0 top
C20  16.97,25.46 270 top
CHG  42.69,5.14 0 top
D1  35.06,11.49 270 top
D2  33.42,18.48 0 top
D3  10.3,12.76 270 top
D4  42.05,34.03 180 top
J1  41.06,15.3 90 top
J4  5.22,21.47 0 top
JP1  5.27,11.27 0 bottom
P1  11.25,42.92 270 top
R1  38.78,14.35 0 top
R2  11.89,4.68 180 top
R3  11.89,2.46 0 top
R4  38.4,22.92 0 top
R5  32.21,5.14 90 top
R6  42.69,6.93 180 top
R7  40.78,48.95 180 top
R8  34.43,32.13 180 top
R9  42.05,35.94 0 top
R10  43.32,8.95 180 top
R11  16.97,31.49 0 top
R12  18.87,41.02 270 top
R13  18.87,45.42 270 top
R14  18.87,48 90 top
R15  18.87,38.16 90 top
R16  20.78,39.75 270 top
R17  13.79,29.27 270 top
R18  15.38,25.78 90 top
R19  31.26,27.05 0 top
R20  34.11,27.05 0 top
RST  42.69,45.78 180 top
S1  23,11.49 0 top
S2  23,19.11 0 top
S3  23,3.87 0 top
S4  15.38,11.49 270 top
S5  30.62,11.49 90 top
STB  42.69,3.23 0 top
SW1  45.93,25.78 90 top
U1  32.52,22.6 90 top
U2  37.29,5.14 0 top
U3  7.42,3.7 180 top
U4  15.38,4.82 180 top
U5  31.05,43.46 180 top
U6  19.51,26.73 270 top
U7  41.41,23.87 90 top
U$1  23,53.4 0 top

### Tracks (layer width: path | path; a pad name or v marks a point on that pad's centre or on a via)
3.3V  (via drill 0.35)
  Top 0.152: U5.32 27.3,50.52 C3.1 26.96,51.34 25.54,52.77 25.54,54.03 | U5.64 34.8,36.37 C6.1 35.38,35.94 | U5.48 23.76,39.71 C7.1 23.64,39.43 v24.59,38.48 | 25.54,54.03 24.91,54.67 23,54.67 U$1.P$2 | 25.54,54.03 26.18,54.67 28.4,54.67 30.3,52.77 33.31,52.77 C2.1 C8.1 33.8,50.69 U5.19 33.8,47.37 35.45,45.71 U5.13 38.32,45.71 C5.1 38.56,47.55 R7.2 39.97,49.41 40.78,50.23 45.54,50.23 45.86,49.91 45.86,42.29 45.03,41.46 BOOT.3 43.03,39.72 42.86,39.56 41.41,38.11 v41.41,37.21 44.18,37.21 45.23,36.16 45.23,33.4 41.91,30.09 U7.7 41.91,25.32 41.41,24.82 32.52,24.82 31.57,23.88 31.57,23.87 U1.5 | R15.2 R12.2 19.51,40.2 R16.2 20.78,37.52 19.97,36.72 17.46,36.72 15.38,38.8 15.38,42.29 15.79,42.7 P1.4 18.65,42.7 v18.87,42.92 | R14.2 18.55,49.14 v18.55,49.91 | v20.46,45.14 19.92,44.61 R13.2 | 35.38,35.94 36.97,35.94 v37.29,35.62 | C9.1 35.23,35.79 35.38,35.94
  Top 0.305: U6.14 21.46,26.48 21.88,26.06 C16.2 21.68,25.26 U6.12 20.27,24.3 C15.2 20.39,23.48 20.14,23.24 | R18.1 15.38,24.19 16.33,23.24 20.14,23.24 | 20.14,23.24 20.46,22.92 v21.09,22.92 | 31.57,23.87 v30.3,23.87
  Bottom 0.152: U$1.P$2 21.73,53.08 v18.55,49.91 20.46,48 v20.46,45.14 20.46,43.24 20.14,42.92 | v18.87,42.92 20.14,42.92 | v24.59,38.48 20.14,42.92 | v37.29,35.62 38.88,37.21 v41.41,37.21
  Bottom 0.305: v21.09,22.92 29.35,22.92 v30.3,23.87
+BATT
  Top 0.508: D1.2 34.86,9.59 31.57,9.59 30.62,8.63 30.62,7.05 27.45,3.87 | 9.89,1.27 5.85,1.27 3.78,3.35 3.78,7.24 JP1.2 | 9.89,1.27 R3.1 | 9.89,1.27 15.64,1.27 18.24,3.87 27.45,3.87 | 27.45,3.87 29.67,1.65 38.17,1.65 U2.5
-BATT
  Top 0.305: C1.2 8.35,8.7 D3.2 14.31,10.65 15.59,9.38 15.59,4.46 16.17,3.87 U4.1
  Top 0.508: C1.2 8.29,7.46 JP1.1 6.54,7.14 5.15,5.75 5.15,3.24 5.64,2.75 U3.6
CENTER
  Top 0.152: S1.3 24.91,12.99 | 24.91,12.99 S1.4 | 24.91,12.99 24.91,18.48 25.22,18.79 27.45,18.79 28.08,19.43 28.08,21.65 27.45,22.29 27.45,31.18 32.3,36.03 U5.59
CH340E->STM32
  Top 0.152: U7.8 41.41,25.46 41.1,25.14 38.88,25.14 38.56,25.46 38.56,35.62 34.75,39.43 30.94,39.43 28.16,42.21 U5.43
CLK
  Top 0.152: P1.5 19.26,43.8 22.43,40.63 22.43,38.59 25.73,35.3 28.71,35.3 29.3,35.88 U5.53
CMD
  Top 0.152: P1.3 18.64,41.6 R12.1 19.05,41.65 20.9,41.65 22.13,40.42 22.13,38.08 25.22,34.98 29.03,34.98 29.8,35.75 U5.54
D0
  Top 0.152: U5.39 23.62,44.21 20.46,47.37 20.46,49.27 19.19,50.54 15.06,50.54 14.64,50.12 14.64,47.16 15.79,46 P1.7 18.6,46 18.83,46.24 R13.1
D1
  Top 0.152: P1.8 18.79,47.1 R14.1 20,47.19 23.48,43.71 U5.40
D2  (via drill 0.35)
  Top 0.152: P1.1 18.64,37.34 R15.1 19.64,37.34 v20.14,37.84 | v27.13,39.11 27.76,39.11 28.3,38.58 U5.51
  Bottom 0.152: v20.14,37.84 20.46,37.52 25.54,37.52 v27.13,39.11
D3  (via drill 0.35)
  Top 0.152: v22.05,36.57 21.73,36.89 21.73,40.06 21.23,40.56 R16.1 19.72,40.56 19.45,40.83 17.02,40.83 16.69,40.5 P1.2 | v28.4,36.26 28.8,36.65 U5.52
  Bottom 0.152: v22.05,36.57 28.08,36.57 v28.4,36.26
D+
  Top 0.152: U7.1 40.41,20.75 40.78,20.38 40.8,20.38 40.82,20.4 42.89,20.4 44.59,18.7 44.59,16.89 43.75,16.05 J1.B6 40.43,16.05 40.18,15.79 40.18,15.3 40.43,15.05 J1.A6
D-
  Top 0.152: 42.94,15.55 J1.A7 | J1.B7 41.94,14.55 42.94,15.55 | 42.94,15.55 43.73,15.55 44.91,16.73 44.91,18.82 43.02,20.71 41.1,20.71 40.91,20.89 U7.2
DAC_OUT1
  Top 0.152: U5.20 33.3,48.14 32.52,47.37 26.49,47.37 22.36,51.5 14.74,51.5 13.16,49.91 13.16,34.49 R11.1
DAC_OUT2
  Top 0.152: U5.21 32.8,48.27 32.21,47.69 26.81,47.69 22.68,51.81 14.63,51.81 12.84,50.02 12.84,36.57 12.85,36.56 12.85,34.34 13.79,33.4 R17.1
DGND  (via drill 0.35)
  Top 0.152: C3.2 27.8,50.73 U5.31 | C5.2 38.33,45.21 U5.12 | C6.2 34.26,37.76 U5.63 | C8.2 34.3,50.56 U5.18 | 44.73,46.89 RST.3 | C7.2 24.05,40.55 24.39,40.21 U5.47 | v39.99,20.06 39.99,18.95 40.46,18.48 41.03,18.48 J1.B1_A12
  Top 0.305: 19.76,26.98 U6.15 | 19.76,26.98 U6.2 19.76,29.65 19.19,30.22 C11.2 | 19.76,26.98 U6.17 19.25,26.48 U6.10
  other vias: 9.03,33.08 32.21,52.13 23,45.78 23.95,44.83 6.6,41.54 46.5,12.44 46.5,18.16 43,14.35 46.5,15.3 30.62,10.54 46.61,8.95 46.61,7.36 14.11,2.66 7.76,16.57 5.22,16.57 1.41,25.46 1.41,28 1.41,30.54 1.41,33.08 1.41,35.62 1.41,38.16 1.41,40.7 1.41,43.24 1.41,45.78 1.41,48.32 1.41,50.86 16.65,54.61 14.11,54.61 11.57,54.61 9.03,54.61 6.49,54.61 3.95,54.61 43.32,54.61 40.78,54.61 38.24,54.61 35.7,54.61 33.16,54.61 30.62,54.61 46.61,33.08 46.61,35.62 46.61,38.16 46.61,40.7 46.61,43.24 46.61,45.78 46.61,48.32 46.61,50.86 14.11,18.79 24.27,11.49 17.92,17.84 24.27,8.95 21.73,2.6 24.27,2.6 15.38,11.49 14.11,43.24 22.05,43.24 14.11,38.16 7.93,38.48 10.62,48.64 9.35,44.51 7.44,30.54 5.22,52.45 9.35,40.7 4.27,30.22 9.35,38.16 7.44,36.26 10.3,35.94 11.57,34.98 11.89,32.13 15.7,17.84 16.33,18.79 22.36,19.05 21.73,20 36.18,11.01 35.06,11.49 43.18,16.71 43.95,18 43.95,11.65 45.07,13.87 44.43,20.54 43.32,21.65 39.67,21.33 44.91,15.62 39.51,21.9 30.59,12.35 25.88,15.94 37.76,9.05 6.42,20.13 2.35,16.57 15.38,36.93 11.25,20 12.55,16.89 22.11,46.73 15.35,20.38 12,22.81 17.6,19.85 29.03,42.92 30.94,41.02 27.13,41.02 29.03,39.11 29.94,42.01 28.04,40.11 27.45,52.13 12.21,8.95 13.47,9.59 19.19,7.05 17.6,49.59 21.21,47.57 21.24,48.88 13.76,48.95 11.61,35.94 17.92,28.95 22.36,26.73 22.68,24.19 36.34,26.09 11.89,5.77 16.97,23.92 33.8,33.4 24.27,4.76 26.81,7.39 20.46,7.39 18.11,7.39 3.95,44.51 7.18,45.09 4.27,41.65 3.32,34.98 11.57,37.84 23.64,42.61 21.41,44.51 20.46,50.54 22.05,50.54 24.27,48 23,49.27 23.64,46.73 23.95,51.81 25.54,49.91 26.81,46.41 33.16,46.41 26.81,43.56 29.98,46.73 29.35,50.54 32.21,50.54 29.35,52.45 36.02,51.81 35.7,49.27 35.06,47.37 36.65,48 38.56,48.95 42.37,50.86 39.19,50.23 42.05,42.92 42.37,47.05 40.46,42.92 39.83,40.38 37.29,38.48 40.46,38.16 39.83,36.26 42.69,32.45 44.27,34.35 44.59,31.18 43,29.59 43,27.36 43.32,25.14 44.59,25.46 44.59,28.64 44.59,26.73 41.1,28.32 39.83,29.59 39.83,33.08 37.61,31.18 37.61,28.64 34.11,28.32 31.57,25.46 28.71,23.87 28.71,26.41 28.71,28 28.71,29.91 29.98,31.49 31.89,32.13 33.16,30.86 35.06,29.91 31.26,29.91 31.26,28.32 32.52,29.91 36.34,29.59 27.76,34.03 26.18,32.45 25.86,29.59 25.86,27.68 25.86,26.09 25.86,24.51 25.86,21.97 22.68,21.97 23.95,18.16 24.27,13.71 20.78,13.71 20.78,14.98 22.68,13.71 22.36,16.57 24.27,15.94 22.68,14.98 20.78,12.12 22.68,12.12 17.92,13.71 17.92,11.81 20.78,6.09 25.22,6.09 23,6.09 21.41,8.63 23,1.39 39.51,1.39 41.1,1.65 42.69,1.65 5.86,27.36 8.71,28.64 11.57,28.32 13.79,26.41 11.89,26.41 8.71,26.41 14.11,22.92 17.6,21.02 23,28.32 23.95,27.68 24.91,25.14 23,29.91 19.19,32.76 18.55,34.67 24.27,29.59 24.27,31.81 22.05,32.13 20.14,35.62 23.32,35.3 23.32,7.36 34.27,25.71 29.03,13.71 29.03,9.27 29.03,11.49 39.19,28
  pour Top (rank 2): -3.67,59.75 -3.67,-3.75 52.21,-3.75 52.21,59.75
  pour Bottom: -4.94,61.02 -4.94,-5.02 53.48,-5.02 53.48,61.02
DOWN  (via drill 0.35)
  Top 0.152: S3.3 S3.4 26.72,5.37 27.76,6.41 27.76,18.48 28.4,19.11 28.4,21.97 27.76,22.6 27.76,30.86 30.3,33.4 30.94,33.4 v31.89,34.35 | U5.10 36.7,44.19 34.75,44.19 v34.11,43.56
  Bottom 0.152: v34.11,43.56 32.84,42.29 32.84,35.3 v31.89,34.35
LEFT
  Top 0.152: U5.58 31.8,36.16 27.13,31.49 27.13,21.97 27.76,21.33 27.76,19.74 27.45,19.43 24.27,19.43 19.93,15.09 S4.3 S4.4 16.99,8
N$1
  Top 0.152: 40.43,17.05 J1.B5 40.31,17.05 39.6,16.34 R1.2 39.9,14.05 J1.A5
N$2
  Top 0.152: U4.6 13.99,4.07 13.73,3.81 10.26,3.81 9.21,2.75 U3.1
N$3
  Top 0.152: U4.4 13.56,6.41 10.42,6.41 U3.3
N$4
  Top 0.152: R5.2 34.63,5.95 U2.2
N$5
  Top 0.152: 11.07,4.37 R2.2 10.44,4.68 9.46,3.7 U3.2
N$6
  Top 0.152: U1.3 35.77,23.71 43.87,23.71 SW1.COM
N$7
  Top 0.152: 12.7,2.42 R3.2 11.92,3.23 10.64,3.23 9.64,2.23 7.91,2.23 6.43,3.7 U3.5 6.64,3.7 7.44,4.5 7.44,4.82 8.39,5.77 9.35,5.77 C1.1
N$8
  Top 0.152: SW1.1 45.08,22.92 R4.2
N$9
  Top 0.152: STB.1 40.61,4.5 U2.6
N$10
  Top 0.152: D2.1 32.58,18.48 37.02,22.92 R4.1 | R19.1 30.44,25.6 29.35,24.51 29.35,22.92 30.85,21.42 U1.1
  Top 0.762: D2.1 35.06,14.72 D1.1
  pour Top (no thermals): 31.26,22.13 31.89,22.13 31.89,18.48 31.41,18 30.62,18 30.62,21.49
N$11
  Top 0.152: U2.7 41.25,5.77 CHG.1
N$12
  Top 0.152: STB.2 CHG.2 43.5,5.16 R6.1
N$13
  Top 0.152: R7.1 41.59,45.69 RST.2 38.88,42.97 38.88,40.7 37.88,39.71 U5.1
N$14  (via drill 0.35)
  Top 0.152: 32.84,37.74 U5.60 32.8,32.81 33.48,32.13 R8.2 33.62,31.6 34.43,30.78 35.74,30.78 36.47,31.51 36.47,33.22 v36.65,33.4 | BOOT.2 43.47,42.17 C13.1 | 40.41,39.11 BOOT.2 | BOOT.2 39.7,39.31 v39.19,38.8
  Bottom 0.152: v39.19,38.8 36.65,36.26 v36.65,33.4
N$15
  Top 0.152: R9.1 41.23,34.1 D4.A
N$16
  Top 0.152: 44.24,9.05 R10.1 45.88,10.69 J1.S3
  Bottom 0.152: J1.S2 J1.S4 J1.S3 J1.S1
N$17
  Top 0.152: C12.1 C11.1 19.04,31.49 R11.2
N$18
  Top 0.152: C12.2 20.27,28.91 U6.1
N$19
  Top 0.305: 10.43,24.82 J4.2 13.58,24.72 16.33,21.97 21.43,21.97 23.95,24.49 23.95,26.41 22.87,27.49 U6.16
N$20
  Top 0.305: U6.5 7.57,27.49 6.32,26.24 J4.3
N$21
  Top 0.152: R17.2 14.44,29.1 C17.1 C14.1
N$22
  Top 0.152: 17.13,30.07 C14.2 18.07,30.07 19.25,28.89 U6.3
N$23
  Top 0.152: U7.10 40.39,26.09 39.68,26.09 C4.2
N$24
  Top 0.305: U6.9 18.75,23.91 C19.1
N$25
  Top 0.305: U6.11 19.76,23.96 C19.2
N$26
  Top 0.305: U6.8 16.99,25.97 C20.1
N$27
  Top 0.152: U6.7 17.92,26.48 | 17.92,26.48 15.5,26.48 R18.2 | U6.6 18.03,26.59 17.92,26.48
PC0  (via drill 0.35)
  Top 0.152: R19.2 R20.1 33.3,29.09 v33.8,29.59 | U5.8 35.67,43.21 35.06,42.61 v35.06,40.7
  Bottom 0.152: v35.06,40.7 35.06,30.86 v33.8,29.59
PC2  (via drill 0.35)
  Top 0.152: 37.91,44.21 v38.24,43.88 | v43.95,35.94 R9.2
  Bottom 0.152: v38.24,43.88 43.95,38.16 v43.95,35.94
RIGHT  (via drill 0.35)
  Top 0.152: S5.3 29.75,8.52 29.75,14.46 S5.4 28.8,15.41 28.8,22.2 28.08,22.92 28.08,30.54 30.3,32.76 31.26,32.76 v31.57,33.08 | U5.9 35.53,43.71 v34.11,42.29
  Bottom 0.152: v34.11,42.29 33.16,41.34 33.16,34.67 v31.57,33.08
SCL
  Top 0.152: U5.29 28.8,48.4 28.4,48 27.26,48 26.29,48.97 26.29,51.38 U$1.P$3
SDA
  Top 0.152: U$1.P$4 27.58,53.4 28.44,52.54 28.44,49.94 28.3,49.8 U5.30
STM32->CH340E
  Top 0.152: U5.42 28.29,42.71 31.26,39.75 35.06,39.75 38.88,35.94 38.88,29.27 40.91,27.23 U7.9
UP
  Top 0.152: S2.3 S2.4 26.6,31.6 31.3,36.3 U5.57
USB_5V  (via drill 0.35)
  Top 0.152: 39.03,17.7 J1.B4_A9
  Top 0.508: 39.03,17.7 38.79,17.46 38.79,11.89 38.88,11.81 | J1.A4_B9 39.97,12.9 38.88,11.81 | 38.88,11.81 v38.88,8.63 38.88,7.94 U2.8 41.75,7.05 R6.2 | v33.16,3.23 U2.4
  Bottom 0.508: v38.88,8.63 33.48,3.23 v33.16,3.23
  pour Top (no thermals): 40.78,18 40.46,18 39.19,19.27 34.27,19.27 34.27,17.84 34.75,17.36 40.78,17.36
  pour Top: 38.72,13.24 40.94,13.24 40.94,12.6 39.67,12.6 39.19,12.12 38.72,12.12